# Altium schematic sheet MPPT_V1.0.1_5V_Supply.SchDoc: MPPT_V1.0
size A4; DrawnBy: Hugo Boyce; Engineer: Hugo Boyce; Organization: Altium Limited; Address1: L3, 12a Rodborough Rd; Address2: Frenchs Forest; Address3: NSW; Address4: Australia 2086; SheetNumber: 4; SheetTotal: 5
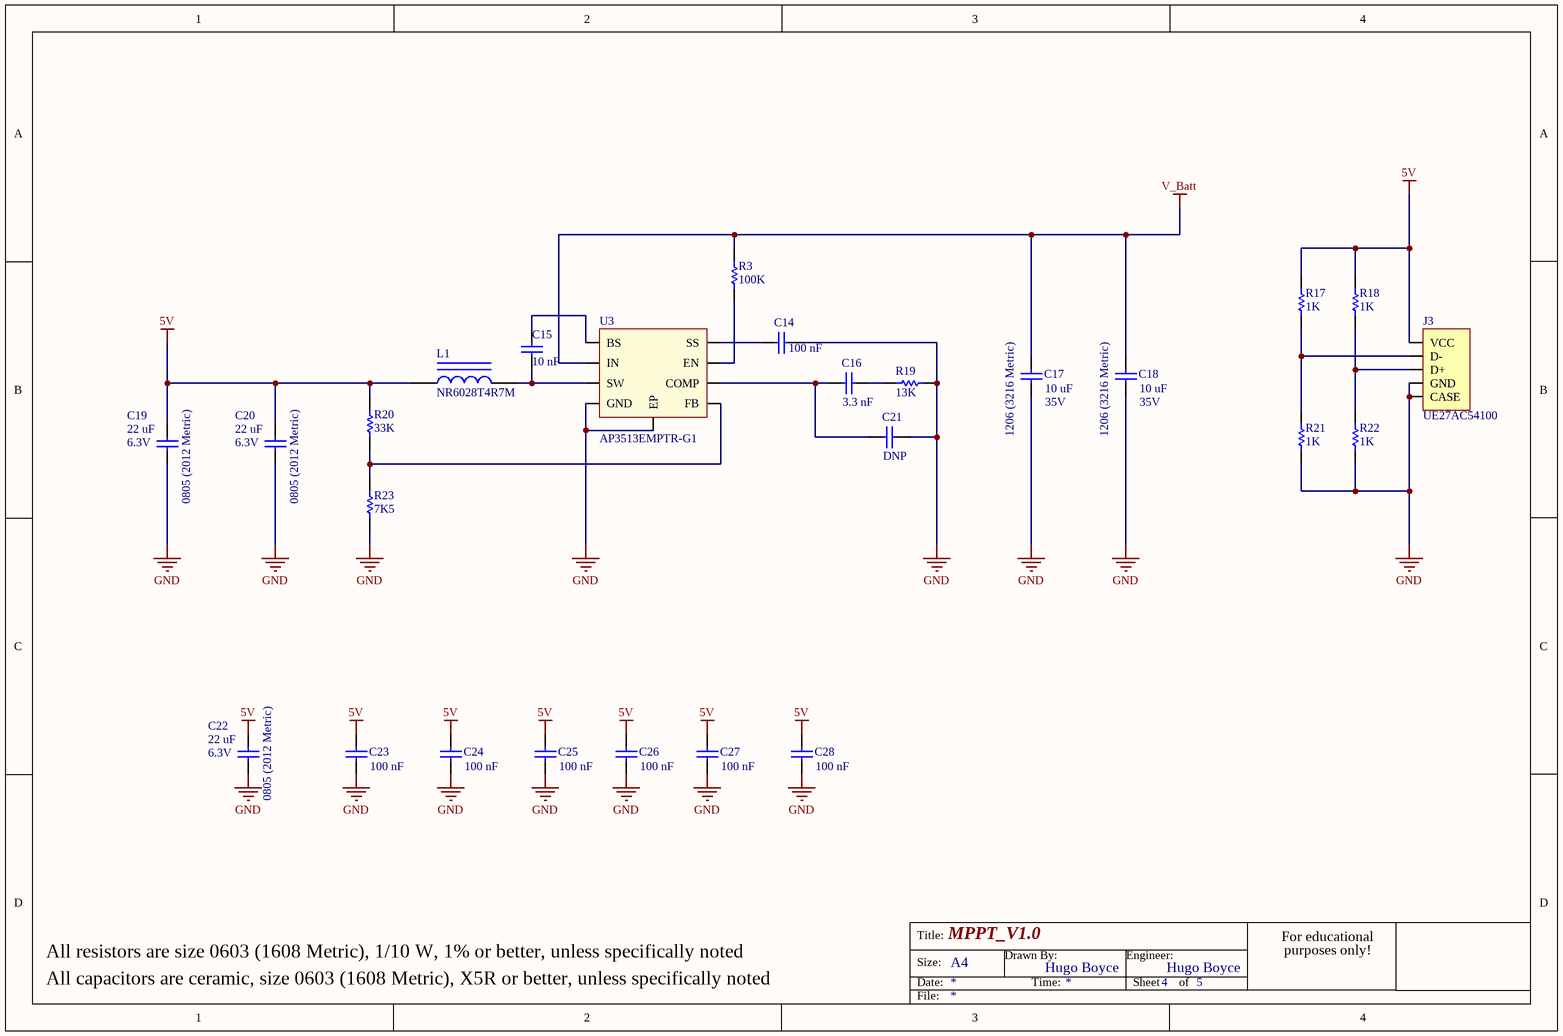
[diagram p0: MPPT_V1.0.1_5V_Supply.SchDoc]

## Parts
C14  value 100 nF  [CAPC1608N]  (hidden comment: Cap SMD)
C15  value 10 nF  [CAPC1608N]  (hidden comment: 1608)
C16  value 3.3 nF  [CAPC1608N]  (hidden comment: Cap SMD)
C17  value 10 uF  Size: 1206 (3216 Metric)  Voltage Rating: 35V  [CAPC3216N]  (hidden comment: Cap SMD)
C18  value 10 uF  Size: 1206 (3216 Metric)  Voltage Rating: 35V  [CAPC3216N]  (hidden comment: Cap SMD)
C19  value 22 uF  Size: 0805 (2012 Metric)  Voltage Rating: 6.3V  [CAPC2012N]  (hidden comment: JMK212BBJ226MGHT)
C20  value 22 uF  Size: 0805 (2012 Metric)  Voltage Rating: 6.3V  [CAPC2012N]  (hidden comment: JMK212BBJ226MGHT)
C21  value DNP  [CAPC1608N]  (hidden comment: Cap SMD)
C22  value 22 uF  Size: 0805 (2012 Metric)  Voltage Rating: 6.3V  [CAPC2012N]  (hidden comment: JMK212BBJ226MGHT)
C23  value 100 nF  [CAPC1608N]  (hidden comment: Cap SMD)
C24  value 100 nF  [CAPC1608N]  (hidden comment: Cap SMD)
C25  value 100 nF  [CAPC1608N]  (hidden comment: Cap SMD)
C26  value 100 nF  [CAPC1608N]  (hidden comment: Cap SMD)
C27  value 100 nF  [CAPC1608N]  (hidden comment: Cap SMD)
C28  value 100 nF  [CAPC1608N]  (hidden comment: Cap SMD)
J3  UE27AC54100  [UE27AC5410]
L1  NR6028T4R7M  [NR6028]
R3  value 100K  [RESC1608N]  (hidden comment: Res SMD)
R17  value 1K  [RESC1608N]  (hidden comment: Res SMD)
R18  value 1K  [RESC1608N]  (hidden comment: Res SMD)
R19  value 13K  [RESC1608N]  (hidden comment: Res SMD)
R20  value 33K  [RESC1608N]  (hidden comment: Res SMD)
R21  value 1K  [RESC1608N]  (hidden comment: Res SMD)
R22  value 1K  [RESC1608N]  (hidden comment: Res SMD)
R23  value 7K5  [RESC1608N]  (hidden comment: Res SMD)
U3  AP3513EMPTR-G1  [AP3513E]

## Nets
5V: C19.2 C20.2 C22.2 C23.2 C24.2 C25.2 C26.2 C27.2 C28.2 J3.1(VCC) L1.1 R17.2 R18.2 R20.2
GND: C14.2 C17.1 C18.1 C19.1 C20.1 C21.2 C22.1 C23.1 C24.1 C25.1 C26.1 C27.1 C28.1 J3.4(GND) J3.5(CASE) R19.2 R21.1 R22.1 R23.1 U3.4(GND) U3.9(EP)
V_Batt: C17.2 C18.2 R3.2 U3.2(IN)
NetC14_1: C14.1 U3.8(SS)
NetC15_1: C15.1 L1.2 U3.3(SW)
NetC15_2: C15.2 U3.1(BS)
NetC16_1: C16.1 C21.1 U3.6(COMP)
NetC16_2: C16.2 R19.1
NetJ3_2: J3.2(D-) R17.1 R21.2
NetJ3_3: J3.3(D+) R18.1 R22.2
NetR3_1: R3.1 U3.7(EN)
NetR20_1: R20.1 R23.2 U3.5(FB)

## Notes on the sheet
- All resistors are size 0603 (1608 Metric), 1/10 W, 1% or better, unless specifically noted
- All capacitors are ceramic, size 0603 (1608 Metric), X5R or better, unless specifically noted
- Title:
- Size:
- Date:
- A4
- Drawn By:
- Time:
- Engineer:
- Sheet
- of
- For educational
- purposes only!
- File:

## Library data of the parts
C14-C28 = Cap SMD: Capacitor; Published: 8-Jun-2000; LatestRevisionDate: 17-Jul-2002; LatestRevisionNote: Re-released for DXP Platform.; PackageReference: RAD-0.3; Publisher: Altium Limited; PackageDescription: Radial Cap, Thru-Hole; 2 Leads; 0.3 in Pin Spacing
J3 = UE27AC54100: CONN RCPT USB TYPE A R/A GOLD; Manufacturer: Amphenol Commercial Products; Connector Type: USB - A; Number of Contacts: 4; Gender: Receptacle; Specifications: USB 2.0; Current Rating: 1A per Contact; Voltage - Rated: 30VAC; Mating Cycles: 1500; Shielding: Shielded; Material Flammability Rating: UL94 V-0; Supplier 1: Digi-Key; RoHS: RoHS Compliant; Category: Connectors, Interconnects; Stock 1: 45705; Pricing 1: 1=0.55, 10=0.519, 25=0.4676, 50=0.4154, 100=0.398, 250=0.3634, 500=0.34608, 1000=0.28552, 2500=0.25956 (CAD); Packaging: Tray; Part Status: Active; Mounting Type: Through Hole, Right Angle; Mounting Feature: Horizontal; Termination: Solder; Features: Board Lock; Ingress Protection: -; Operating Temperature: -40°C ~ 85°C; Contact Finish: Gold; Shell/Shielding Material: Copper Alloy; Insulation Color: Black; ComponentLink1URL: https://www.amphenolcanada.com/ProductSearch/drawings/AC/UE27ACX4X0X.pdf; ComponentLink1Description: https://www.amphenolcanada.com/ProductSearch/drawings/AC/UE27ACX4X0X.pdf; Supplier Part Number 1: UE27AC54100-ND; Manufacturer Part Number: UE27AC54100
L1 = NR6028T4R7M: FIXED IND 4.7UH 3A 40.3 MOHM SMD; Manufacturer: Taiyo Yuden; Type: Wirewound; Material - Core: Ferrite; Tolerance: ±20%; Shielding: Shielded; DC Resistance (DCR): 40.3 mOhm Max; Supplier 1: Digi-Key; RoHS: RoHS Compliant; Category: Inductors, Coils, Chokes; Stock 1: 64654; Pricing 1: 1=0.53, 10=0.47, 100=0.3235, 500=0.27646, 1000=0.21175 (CAD); Packaging: Cut Tape (CT); Part Status: Active; Q @ Freq: -; Ratings: -; Operating Temperature: -25°C ~ 120°C; Mounting Type: Surface Mount; Package / Case: Nonstandard; Supplier Device Package: -; Size / Dimension: 0.236" L x 0.236" W (6.00mm x 6.00mm); Height - Seated (Max): 0.110" (2.80mm); ComponentLink1URL: https://www.yuden.co.jp/productdata/catalog/wound04_e.pdf; ComponentLink1Description: https://www.yuden.co.jp/productdata/catalog/wound04_e.pdf; Supplier Part Number 1: 587-2100-1-ND; Manufacturer Part Number: NR6028T4R7M
R3 R17-R23 = Res SMD: Resistor; Published: 8-Jun-2000; LatestRevisionDate: 17-Jul-2002; LatestRevisionNote: Re-released for DXP Platform.; PackageReference: AXIAL-0.3; Publisher: Altium Limited; PackageDescription: Axial Device, Thru-Hole; 2 Leads; 0.3 in Pin Spacing
U3 = AP3513EMPTR-G1: IC REG BUCK ADJ 3A SYNC 8SOIC; Manufacturer: Diodes Incorporated; Function: Step-Down; Output Configuration: Positive; Output Type: Adjustable; Number of Outputs: 1; Voltage - Input (Min): 4.5V; Voltage - Input (Max): 18V; Voltage - Output (Min/Fixed): 0.925V; Voltage - Output (Max): 16.2V; Frequency - Switching: 500kHz; Synchronous Rectifier: Yes; Supplier 1: Digi-Key; RoHS: RoHS Compliant; Category: Integrated Circuits (ICs); Stock 1: 23505; Pricing 1: 1=0.92, 10=0.791, 100=0.5905, 500=0.46394, 1000=0.3585 (CAD); Packaging: Cut Tape (CT); Part Status: Active; Topology: Buck; Current - Output: 3A; Operating Temperature: -40°C ~ 85°C (TA); Mounting Type: Surface Mount; Package / Case: 8-SOIC (0.154", 3.90mm Width) Exposed Pad; Supplier Device Package: 8-PSOP; ComponentLink1URL: https://www.diodes.com/assets/Datasheets/AP3513E.pdf; ComponentLink1Description: https://www.diodes.com/assets/Datasheets/AP3513E.pdf; Supplier Part Number 1: AP3513EMPTR-G1DICT-ND; Manufacturer Part Number: AP3513EMPTR-G1